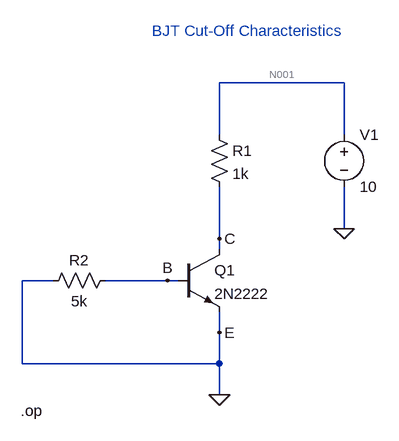
[diagram p0: schematic 10 BJT Cut-Off Characteristics.asc]
10 BJT Cut-Off Characteristics.asc, the LTspice schematic file:
Version 4
SHEET 1 880 680
WIRE 272 -32 80 -32
WIRE 80 48 80 -32
WIRE 272 48 272 -32
WIRE 272 192 272 128
WIRE 80 208 80 128
WIRE 80 224 80 208
WIRE -176 272 -224 272
WIRE 0 272 -96 272
WIRE 16 272 0 272
WIRE 80 352 80 320
WIRE -224 400 -224 272
WIRE 80 400 80 352
WIRE 80 400 -224 400
WIRE 80 448 80 400
FLAG 80 448 0
FLAG 272 192 0
FLAG 0 272 B
FLAG 80 352 E
FLAG 80 208 C
SYMBOL voltage 272 32 R0
WINDOW 123 0 0 Left 0
WINDOW 39 0 0 Left 0
SYMATTR InstName V1
SYMATTR Value 10
SYMBOL npn 16 224 R0
SYMATTR InstName Q1
SYMATTR Value 2N2222
SYMBOL res 64 32 R0
SYMATTR InstName R1
SYMATTR Value 1k
SYMBOL res -80 256 R90
WINDOW 0 0 56 VBottom 2
WINDOW 3 32 56 VTop 2
SYMATTR InstName R2
SYMATTR Value 5k
TEXT -226 472 Left 2 !.op
TEXT -24 -112 Left 2 ;BJT Cut-Off Characteristics

The netlist it stands for:
* 10 BJT Cut-Off Characteristics.asc
V1 N001 0 10
Q1 C B 0 0 2N2222
R1 N001 C 1k
R2 B 0 5k
.model NPN NPN
.model PNP PNP
.lib standard.bjt
.op
* BJT Cut-Off Characteristics
.backanno
.end

* Results of the author's LTspice run, read from the files saved beside the schematic
* Operating Point:
*   V(n001) = 10 V
*   V(c) = 10 V
*   V(b) = 50.02 nV
*   Ic(Q1) = 10.02 pA
*   Ib(Q1) = -10 pA
*   Ie(Q1) = -11 fA
*   I(R2) = 10 pA
*   I(R1) = 10.01 pA
*   I(V1) = -10.01 pA
* From the log:
*   Semiconductor Device Operating Points:
*                           --- Bipolar Transistors ---
*   Name:       q1
*   Model:    2n2222
*   Ib:      -1.00e-11
*   Ic:       1.00e-11
*   Vbe:      5.00e-08
*   Vbc:     -1.00e+01
*   Vce:      1.00e+01
*   BetaDC:  -1.00e+00
*   Gm:       4.25e-13
*   Rpi:      9.98e+11
*   Rx:       1.00e+01
*   Ro:       1.00e+16
*   Cbe:      2.50e-11
*   Cbc:      3.32e-12
*   Cjs:      0.00e+00
*   BetaAC:   4.24e-01
*   Cbx:      0.00e+00
*   Ft:       5.10e-03